# Altium schematic sheet M-LVDS_PHY.SchDoc: Sayma AMC
size 420 x 297 mm; $$Internal___BlkDate: 0:12:25_2-9-18; $$Internal_NAME_PLACEHOLDER: a3sheet; $$Internal_Resolution: 00001mm; $$NotCommonProperty_@NAME: M-LVDS_PHY; $$NotCommonProperty_@PRINTORDER: 8; $$NotCommonProperty_@SHEET: 1; $$NotCommonProperty_@SHEETTOTAL: 30; CmpIndex: 0; Drawing Author: G.Kasprowicz; Drawing Number: Sayma AMC; Drawing Project: AMC FMC Carrier Board; Drawing Revision: 2.0; SymIndex: 2141; CheckedBy: P.Kulik,T.Przywozki,W.Ruclo; Author: G.Kasprowicz; CompanyName: WUT ISE; DrawnBy: G.Kasprowicz; Organization: WUT ISE; Address1: PW ISE; Address2: Nowowiejska 15/19 00-665 Warsaw; Address3: gkasprow@gmail.com; DocumentNumber: 11; Revision: 2; SheetNumber: 11; SheetTotal: 32; ModifiedBy: -; CheckedDate: -; Title2: M-LVDS PHY; DivGrp: WUT ISE; Designer: G.Kasprowicz; ModifiedDate: -; ProjectName: Sensor Box
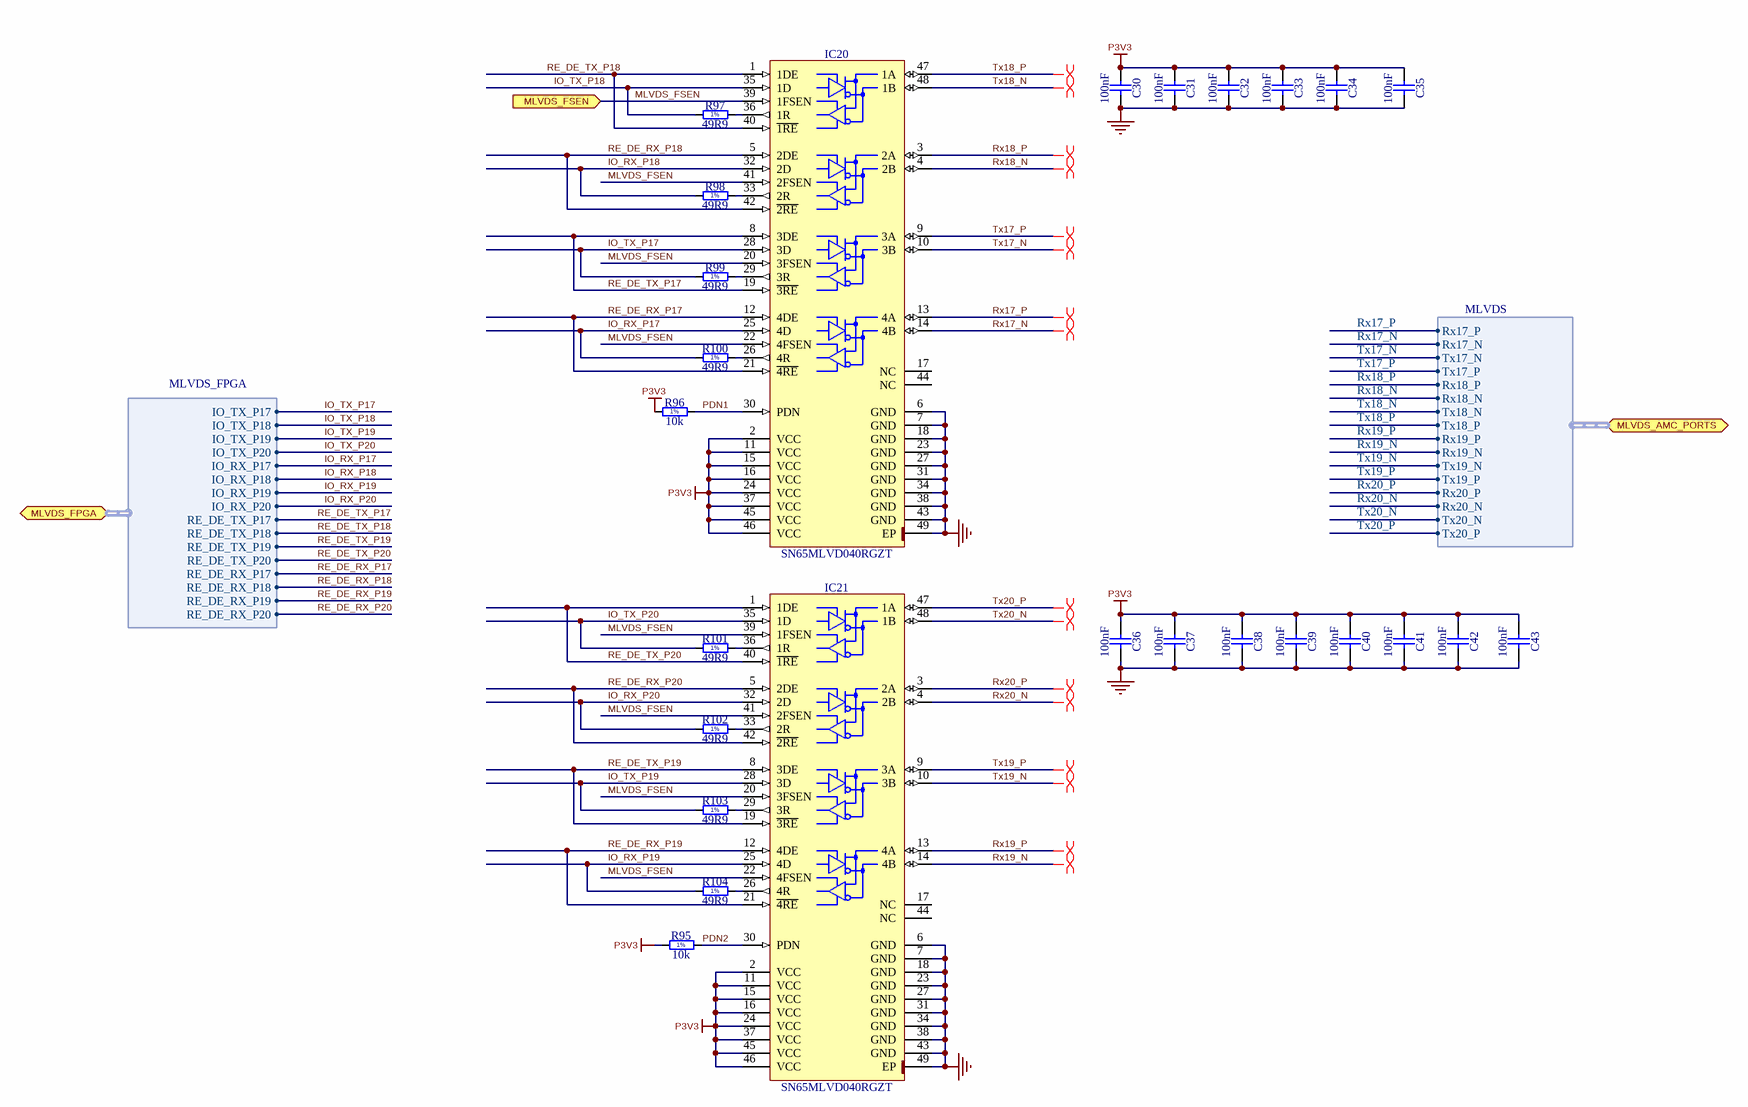
[diagram p0: M-LVDS_PHY.SchDoc]

## Parts
C30  100nF  [CAPC0603X33N]
C31  100nF  [CAPC0603X33N]
C32  100nF  [CAPC0603X33N]
C33  100nF  [CAPC0603X33N]
C34  100nF  [CAPC0603X33N]
C35  100nF  [CAPC0603X33N]
C36  100nF  [CAPC0603X33N]
C37  100nF  [CAPC0603X33N]
C38  100nF  [CAPC0603X33N]
C39  100nF  [CAPC0603X33N]
C40  100nF  [CAPC0603X33N]
C41  100nF  [CAPC0603X33N]
C42  100nF  [CAPC0603X33N]
C43  100nF  [CAPC0603X33N]
IC20  SN65MLVD040RGZT  [QFN50P700X700X100-49N-S420]
IC21  SN65MLVD040RGZT  [QFN50P700X700X100-49N-S420]
R95  10k  [RESC1005X40N]
R96  10k  [RESC1005X40N]
R97  49R9  [RESC1005X40N]
R98  49R9  [RESC1005X40N]
R99  49R9  [RESC1005X40N]
R100  49R9  [RESC1005X40N]
R101  49R9  [RESC1005X40N]
R102  49R9  [RESC1005X40N]
R103  49R9  [RESC1005X40N]
R104  49R9  [RESC1005X40N]

## Ports
MLVDS_AMC_PORTS (bidir, harness MLVDS), MLVDS_FPGA (bidir, harness MLVDS_FPGA), MLVDS_FSEN (in)

## Harnesses
MLVDS: Rx17_P, Rx17_N, Tx17_N, Tx17_P, Rx18_P, Rx18_N, Tx18_N, Tx18_P, Rx19_P, Rx19_N, Tx19_N, Tx19_P, Rx20_P, Rx20_N, Tx20_N, Tx20_P
MLVDS_FPGA: IO_TX_P17, IO_TX_P18, IO_TX_P19, IO_TX_P20, IO_RX_P17, IO_RX_P18, IO_RX_P19, IO_RX_P20, RE_DE_TX_P17, RE_DE_TX_P18, RE_DE_TX_P19, RE_DE_TX_P20, RE_DE_RX_P17, RE_DE_RX_P18, RE_DE_RX_P19, RE_DE_RX_P20

## Nets
GND: C30.2 C31.2 C32.2 C33.2 C34.2 C35.2 C36.2 C37.2 C38.2 C39.2 C40.2 C41.2 C42.2 C43.2 IC20.6(GND) IC20.7(GND) IC20.18(GND) IC20.23(GND) IC20.27(GND) IC20.31(GND) IC20.34(GND) IC20.38(GND) IC20.43(GND) IC20.49(EP) IC21.6(GND) IC21.7(GND) IC21.18(GND) IC21.23(GND) IC21.27(GND) IC21.31(GND) IC21.34(GND) IC21.38(GND) IC21.43(GND) IC21.49(EP)
P3V3: C30.1 C31.1 C32.1 C33.1 C34.1 C35.1 C36.1 C37.1 C38.1 C39.1 C40.1 C41.1 C42.1 C43.1 IC20.2(VCC) IC20.11(VCC) IC20.15(VCC) IC20.16(VCC) IC20.24(VCC) IC20.37(VCC) IC20.45(VCC) IC20.46(VCC) IC21.2(VCC) IC21.11(VCC) IC21.15(VCC) IC21.16(VCC) IC21.24(VCC) IC21.37(VCC) IC21.45(VCC) IC21.46(VCC) R95.1 R96.1
IO_RX_P17: IC20.25(4D) R100.1 ; port MLVDS_FPGA.IO_RX_P17
IO_RX_P18: IC20.32(2D) R98.1 ; port MLVDS_FPGA.IO_RX_P18
IO_RX_P19: IC21.25(4D) R104.1 ; port MLVDS_FPGA.IO_RX_P19
IO_RX_P20: IC21.32(2D) R102.1 ; port MLVDS_FPGA.IO_RX_P20
IO_TX_P17: IC20.28(3D) R99.1 ; port MLVDS_FPGA.IO_TX_P17
IO_TX_P18: IC20.35(1D) R97.1 ; port MLVDS_FPGA.IO_TX_P18
IO_TX_P19: IC21.28(3D) R103.1 ; port MLVDS_FPGA.IO_TX_P19
IO_TX_P20: IC21.35(1D) R101.1 ; port MLVDS_FPGA.IO_TX_P20
MLVDS_FSEN: IC20.20(3FSEN) IC20.22(4FSEN) IC20.39(1FSEN) IC20.41(2FSEN) IC21.20(3FSEN) IC21.22(4FSEN) IC21.39(1FSEN) IC21.41(2FSEN) ; port MLVDS_FSEN
PDN1: IC20.30(PDN) R96.2
PDN2: IC21.30(PDN) R95.2
RE_DE_RX_P17: IC20.12(4DE) IC20.21(~{4RE}) ; port MLVDS_FPGA.RE_DE_RX_P17
RE_DE_RX_P18: IC20.5(2DE) IC20.42(~{2RE}) ; port MLVDS_FPGA.RE_DE_RX_P18
RE_DE_RX_P19: IC21.12(4DE) IC21.21(~{4RE}) ; port MLVDS_FPGA.RE_DE_RX_P19
RE_DE_RX_P20: IC21.5(2DE) IC21.42(~{2RE}) ; port MLVDS_FPGA.RE_DE_RX_P20
RE_DE_TX_P17: IC20.8(3DE) IC20.19(~{3RE}) ; port MLVDS_FPGA.RE_DE_TX_P17
RE_DE_TX_P18: IC20.1(1DE) IC20.40(~{1RE}) ; port MLVDS_FPGA.RE_DE_TX_P18
RE_DE_TX_P19: IC21.8(3DE) IC21.19(~{3RE}) ; port MLVDS_FPGA.RE_DE_TX_P19
RE_DE_TX_P20: IC21.1(1DE) IC21.40(~{1RE}) ; port MLVDS_FPGA.RE_DE_TX_P20
Rx17_N: IC20.14(4B) ; port MLVDS_AMC_PORTS.Rx17_N
Rx17_P: IC20.13(4A) ; port MLVDS_AMC_PORTS.Rx17_P
Rx18_N: IC20.4(2B) ; port MLVDS_AMC_PORTS.Rx18_N
Rx18_P: IC20.3(2A) ; port MLVDS_AMC_PORTS.Rx18_P
Rx19_N: IC21.14(4B) ; port MLVDS_AMC_PORTS.Rx19_N
Rx19_P: IC21.13(4A) ; port MLVDS_AMC_PORTS.Rx19_P
Rx20_N: IC21.4(2B) ; port MLVDS_AMC_PORTS.Rx20_N
Rx20_P: IC21.3(2A) ; port MLVDS_AMC_PORTS.Rx20_P
Tx17_N: IC20.10(3B) ; port MLVDS_AMC_PORTS.Tx17_N
Tx17_P: IC20.9(3A) ; port MLVDS_AMC_PORTS.Tx17_P
Tx18_N: IC20.48(1B) ; port MLVDS_AMC_PORTS.Tx18_N
Tx18_P: IC20.47(1A) ; port MLVDS_AMC_PORTS.Tx18_P
Tx19_N: IC21.10(3B) ; port MLVDS_AMC_PORTS.Tx19_N
Tx19_P: IC21.9(3A) ; port MLVDS_AMC_PORTS.Tx19_P
Tx20_N: IC21.48(1B) ; port MLVDS_AMC_PORTS.Tx20_N
Tx20_P: IC21.47(1A) ; port MLVDS_AMC_PORTS.Tx20_P
NetIC20_26: IC20.26(4R) R100.2
NetIC20_29: IC20.29(3R) R99.2
NetIC20_33: IC20.33(2R) R98.2
NetIC20_36: IC20.36(1R) R97.2
NetIC21_26: IC21.26(4R) R104.2
NetIC21_29: IC21.29(3R) R103.2
NetIC21_33: IC21.33(2R) R102.2
NetIC21_36: IC21.36(1R) R101.2

Not connected (* = marked no-connect by the designer): IC20 17(NC) 44(NC); IC21 17(NC) 44(NC)

## Layout directives
differential pair: Rx17_N, Rx17_P, Rx18_N, Rx18_P, Rx19_N, Rx19_P, Rx20_N, Rx20_P, Tx17_N, Tx17_P, Tx18_N, Tx18_P, Tx19_N, Tx19_P, Tx20_N, Tx20_P

## Notes on the sheet
- Project/Equipment
- Document
- Designer
- Drawn by
- Check.by
- Copyright WUT ISE 2018.
  This documentation describes Open Hardware and is licensed under the CERN OHL v.1.1. You may redistribute and modify this documentation under the terms of the CERN OHL v.1.1. (http://ohwr.org/CERNOHL). This documentation is distributed WITHOUT ANY EXPRESS OR IMPLIED WARRANTY, INCLUDING OF MERCHANTABILITY, SATISFACTORY QUALITY AND FITNESS FOR A PARTICULAR PURPOSE. Please see the CERN OHL v.1.1 for applicable conditions.
- Contact
- File
- Last Mod.
- Print Date
- Sheet
- Size
- A3
- of
- Rev
- (in symbol R0402_10K_1%_0.0625W_100PPM) 1%
- (in symbol R0402_49R9_1%_0.0625W_100PPM) 1%

## Library data of the parts
C30-C43 = CC0201_100NF_6.3V_10%_X5R: Non-polarised capacitor; Manufacturer: GENERIC; Part Description: SMD Multilayer Chip Ceramic Capacitor; Manufacturer1 Part Number: 02016D104KAT2A; Tolerance: ±10%; Voltage: 6.3V; TC: X5R; Manufacturer Part Number: CC0201_100NF_6.3V_10%_X5R; Part Number: CC0201_100NF_6.3V_10%_X5R; Value: 100nF; Component Kind: Standard; Component Type: Standard; Pin Count: 2; Status: Not Recommended; Case: 0201; Mounted: Yes; Socket: No; SMD: Yes; Sense: No; Manufacturer1 Example: AVX; Manufacturer1 ComponentHeight: 0.33mm; HelpURL: \\cern.ch\dfs\Applications\Altium\Datasheets\CC0201_X5R_AVX.pdf; Author: CERN DEM JLC; CreateDate: 03.12.2007; LatestRevisionDate: 03.12.2007
IC20 IC21 = SN65MLVD040RGZT: 4-Channel Half-Duplex M-LVDS Line Transceiver; Manufacturer: TEXAS INSTRUMENTS; PressFit: No; Bonding: No; Manufacturer Part Number: SN65MLVD040RGZT; PackageDescription: QFN, 0.50mm Pitch, Square; 48 Pin, 7.00mm L X 7.00mm W X 1mm H body (W/Thermal Tab 4.2mm X 4.2mm), IPC Medium Density; Part Description: 4-Channel Half-Duplex M-LVDS Line Transceiver; Part Number: SN65MLVD040RGZT; Component Kind: Standard; Component Type: Standard; Device: SN65MLVD040RGZT; Pin Count: 49; Case: QFN48; Mounted: Yes; Socket: No; SMD: Yes; Sense: No; ComponentHeight: 1mm; Author: CERN DEM JLC; HelpURL: \\cern.ch\dfs\Applications\Altium\Datasheets\SN65MLVD040RGZT.pdf; CreateDate: 17.03.2011; LatestRevisionDate: 17.03.2011
R95 R96 = R0402_10K_1%_0.0625W_100PPM: Resistor - 1%; Manufacturer: GENERIC; Part Description: General Purpose Thick Film Chip Resistor; Manufacturer1 Part Number: 232270671003L; TC: ±100ppm/°C; PressFit: No; Manufacturer Part Number: R0402_10K_1%_0.0625W_100PPM; Part Number: R0402_10K_1%_0.0625W_100PPM; Tolerance: ±1%; Value: 10k; Component Kind: Standard; Component Type: Standard; Pin Count: 2; Status: Not Recommended; Power: 0.0625W; Case: 0402; Mounted: Yes; Sense: No; Socket: No; SMD: Yes; Manufacturer1 Example: YAGEO PHYCOMP; Manufacturer1 ComponentHeight: 0.4mm; HelpURL: \\cern.ch\dfs\Applications\Altium\Datasheets\R0402_Phycomp_RC0402.pdf; Author: CERN DEM JLC; CreateDate: 03.12.2007; LatestRevisionDate: 17.10.2012
R97-R104 = R0402_49R9_1%_0.0625W_100PPM: Resistor - 1%; Manufacturer: GENERIC; Part Description: General Purpose Thick Film Chip Resistor; Manufacturer1 Part Number: 232270674999L or RC0402FR-0749R9L; TC: ±100ppm/°C; PressFit: No; Manufacturer Part Number: R0402_49R9_1%_0.0625W_100PPM; Part Number: R0402_49R9_1%_0.0625W_100PPM; Tolerance: ±1%; Value: 49R9; Component Kind: Standard; Component Type: Standard; Pin Count: 2; Status: Not Recommended; Power: 0.0625W; Case: 0402; Mounted: Yes; Sense: No; Socket: No; SMD: Yes; Manufacturer1 Example: YAGEO PHYCOMP; Manufacturer1 ComponentHeight: 0.4mm; HelpURL: \\cern.ch\dfs\Applications\Altium\Datasheets\R0402_Phycomp_RC0402.pdf; Author: CERN DEM JLC; CreateDate: 24.10.2012; LatestRevisionDate: 24.10.2012